# EAGLE design main (EAGLE 6.1)
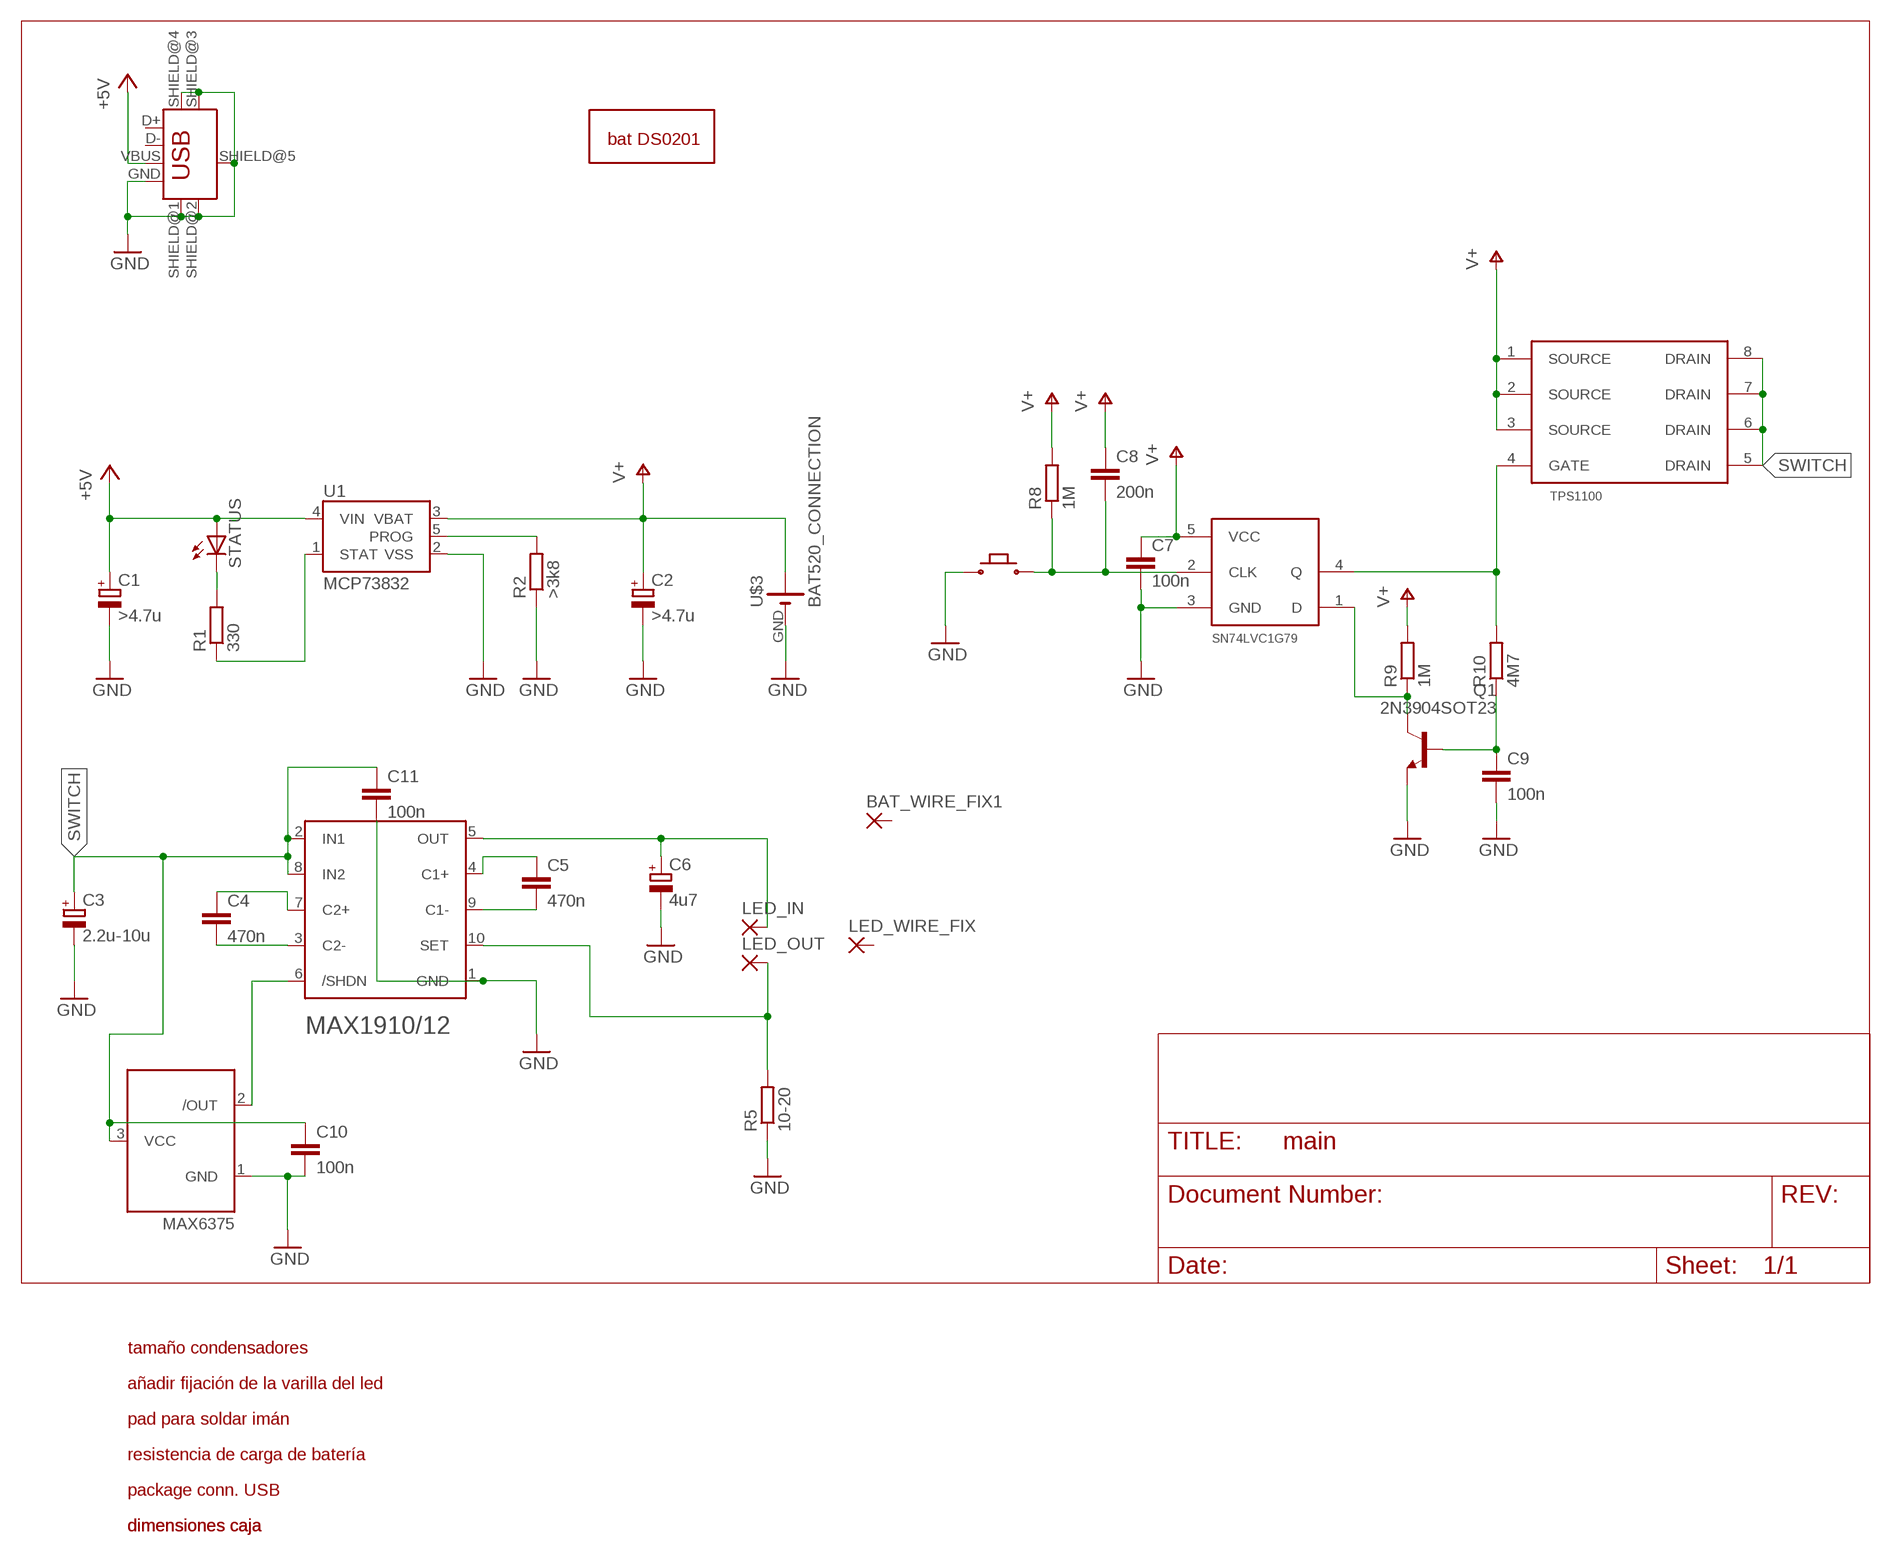
[diagram p0: schematic, sheet 1]

## Parts
BAT_WIRE_FIX1  SMD5  [SMD2,54-5,08]
C1  >4.7u  CPOL-EUSMCB  [SMC_B]
C2  >4.7u  CPOL-EUSMCB  [SMC_B]
C3  2.2u-10u  CPOL-EUSMCB  [SMC_B]
C4  470n  C-EUC1206  [C1206]
C5  470n  C-EUC1206  [C1206]
C6  4u7  CPOL-EUSMCB  [SMC_B]
C7  100n  C-EUC1206  [C1206]
C8  200n  C-EUC1206  [C1206]
C9  100n  C-EUC1206  [C1206]
C10  100n  C-EUC1206  [C1206]
C11  100n  C-EUC1206  [C1206]
LED_IN  SMD2  [SMD1,27-2,54]
LED_OUT  SMD2  [SMD1,27-2,54]
LED_WIRE_FIX  SMD5  [SMD2,54-5,08]
Q1  2N3904SOT23  [SOT23]
R1  330  R-EU_R1206  [R1206]
R2  >3k8  R-EU_R1206  [R1206]
R5  10-20  R-EU_R1206  [R1206]
R8  1M  R-EU_R0805  [R0805]
R9  1M  R-EU_R0805  [R0805]
R10  4M7  R-EU_R1206  [R1206]
STATUS  LEDCHIPLED_1206  [CHIPLED_1206]
U1  MCP73832  [SOT23-5]
U$1  MAX1910/12  [UMAX/USOP_10L]
U$2  MAX6375  [SC70-3-W]
U$3  BAT520_CONNECTION  [BAT520_CONN_SMD]
U$4  BAT_DS0201_PACKAGE  [BAT_DS0201]
U$5  MICROUSB_B  [USB-MICROB]
U$6  MICROBUTTONE-MERCHAN  [MICROBUTTON_2]
U$7  SN74LVC1G79  [SOT23-5]
U$8  TPS1100  [SO08]

## Nets
+5V: C1.+ STATUS.A U1.4(VIN) U$5.VBUS
GND: C1.- C2.- C3.- C6.- C7.2 C9.2 C10.2 C11.2 Q1.2(E) R2.1 R5.1 U1.2(VSS) U$1.1(GND) U$2.1(GND) U$3.GND(-) U$5.GND U$5.SHIELD@1(SHIELD) U$5.SHIELD@2(SHIELD) U$5.SHIELD@3(SHIELD) U$5.SHIELD@4(SHIELD) U$5.SHIELD@5(SHIELD) U$6.P$1 U$7.3(GND)
N$1: Q1.3(C) R9.1 U$7.1(D)
N$2: R1.2 STATUS.C
N$3: R2.2 U1.5(PROG)
N$4: R1.1 U1.1(STAT)
N$5: C4.2 U$1.3(C2-)
N$6: C4.1 U$1.7(C2+)
N$7: C5.2 U$1.9(C1-)
N$8: C5.1 U$1.4(C1+)
N$12: LED_OUT.1(P) R5.2 U$1.10(SET)
N$14: C6.+ LED_IN.1(P) U$1.5(OUT)
N$15: U$1.6(/SHDN) U$2.2(/OUT)
N$16: C8.2 R8.1 U$6.P$2 U$7.2(CLK)
N$18: C9.1 Q1.1(B) R10.1
N$19: R10.2 U$7.4(Q) U$8.4(GATE)
SWITCH: C3.+ C10.1 C11.1 U$1.2(IN1) U$1.8(IN2) U$2.3(VCC) U$8.5(DRAIN) U$8.6(DRAIN) U$8.7(DRAIN) U$8.8(DRAIN)
V+: C2.+ C7.1 C8.1 R8.2 R9.2 U1.3(VBAT) U$3.VCC(+) U$7.5(VCC) U$8.1(SOURCE) U$8.2(SOURCE) U$8.3(SOURCE)
Unconnected: BAT_WIRE_FIX1.1(P) LED_WIRE_FIX.1(P) U$5.D+ U$5.D-

## Notes on the sheet
- tamaño condensadores
- añadir fijación de la varilla del led
- pad para soldar imán
- resistencia de carga de batería
- package conn. USB
- dimensiones caja | dimensiones caja

## Library data of the parts
BAT_WIRE_FIX1 LED_WIRE_FIX = wirepad:SMD5: SMD PAD
C1-C3 C6 = rcl:CPOL-EU: POLARIZED CAPACITOR, European symbol
C4 C5 C7-C11 = rcl:C-EU: CAPACITOR, European symbol
LED_IN LED_OUT = wirepad:SMD2: SMD PAD
Q1 = dan:2N3904: NPN Transistor
R1 R2 R5 R8-R10 = rcl:R-EU_: RESISTOR, European symbol
STATUS = led:LED: LED OSRAM: - CHIPLED LG R971, LG N971, LY N971, LG Q971, LY Q971, LO R971, LY R971 LH N974, LH R974 LS Q976, LO Q976, LY Q976 LO Q996 - Hyper CHIPLED LW Q18S LB Q993, LB Q99A, LB R99A - SideLED LS A670, LO A670, LY A670, LG A670, LP A670 LB A673, LV A673, LT A673, LW A673 LH A674 LY A675 LS A676, LA A676, LO A676, LY A676, LW A676 LS A679, LY A679, LG A679 - Hyper Micro SIDELED® LS Y876, LA Y876, LO Y876, LY Y876 LT Y87S - SmartLED LW L88C, LW L88S LB L89C, LB L89S, LG L890 LS L89K, LO L89K, LY L89K LS L896, LA L896, LO L896, LY L896 - TOPLED LS T670, LO T670, LY T670, LG T670, LP T670 LSG T670, LSP T670, LSY T670, LOP T670, LYG T670 LG T671, LOG T671, LSG T671 LB T673, LV T673, LT T673, LW T673 LH T674 LS T676, LA T676, LO T676, LY T676, LB T676, LH T676, LSB T676, LW T676 LB T67C, LV T67C, LT T67C, LS T67K, LO T67K, LY T67K, LW E67C LS E67B, LA E67B, LO E67B, LY E67B, LB E67C, LV E67C, LT E67C LW T67C LS T679, LY T679, LG T679 LS T770, LO T770, LY T770, LG T770, LP T770 LB T773, LV T773, LT T773, LW T773 LH T774 LS E675, LA E675, LY E675, LS T675 LS T776, LA T776, LO T776, LY T776, LB T776 LHGB T686 LT T68C, LB T68C - Hyper Mini TOPLED® LB M676 - Mini TOPLED Santana® LG M470 LS M47K, LO M47K, LY M47K Source: http://www.osram.convergy.de LUXEON: - LUMILED® LXK2-PW12-R00, LXK2-PW12-S00, LXK2-PW14-U00, LXK2-PW14-V00 LXK2-PM12-R00, LXK2-PM12-S00, LXK2-PM14-U00 LXK2-PE12-Q00, LXK2-PE12-R00, LXK2-PE12-S00, LXK2-PE14-T00, LXK2-PE14-U00 LXK2-PB12-K00, LXK2-PB12-L00, LXK2-PB12-M00, LXK2-PB14-N00, LXK2-PB14-P00, LXK2-PB14-Q00 LXK2-PR12-L00, LXK2-PR12-M00, LXK2-PR14-Q00, LXK2-PR14-R00 LXK2-PD12-Q00, LXK2-PD12-R00, LXK2-PD12-S00 LXK2-PH12-R00, LXK2-PH12-S00 LXK2-PL12-P00, LXK2-PL12-Q00, LXK2-PL12-R00 Source: www.luxeon.com KINGBRIGHT: KA-3528ASYC Source: www.kingbright.com
U1 = dan:MCP73832: Microchip's MCP73832 Miniature single cell, fully integrated Li-Ion, Li-polymer charge management controller http://ww1.microchip.com/downloads/en/DeviceDoc/21984a.pdf
U$1 = dan:MAX1910/12: MAX1910/12 1.5X/2X High-Efficiency White LED Charge Pumps
U$2 = dan:MAX6375: MAX6375 3 pin, ultra-low-power sc70/sot23 voltage detectors
U$3 = dan:BAT520_CONNECTION
U$4 = dan:BAT_DS0201_PACKAGE
U$5 = dan:MICROUSB_B: USB+Shield USB connector with shield pins connectable
U$6 = dan:MICROBUTTON
U$7 = dan:SN74LVC1G79
U$8 = dan:TPS1100

## Board
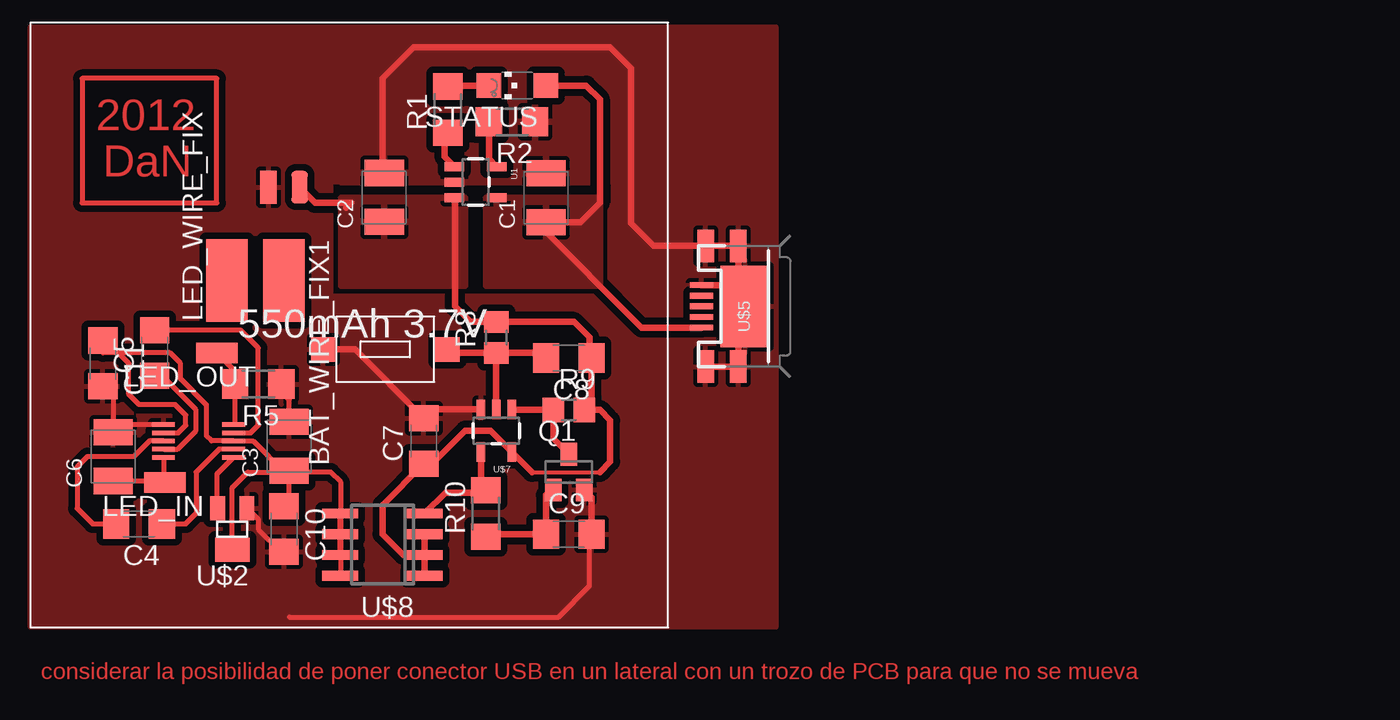
[diagram p1: board, top side]

No outline drawn. Coordinates in mm, seen from the top.
Copper layers (1*16): Top 0.035mm / dielectric 1.5mm / Bottom 0.035mm
Design rules: minimum track width 10mil, minimum drill 24mil, track to track 16mil, track to pad 16mil, pad to pad 16mil, via to via 16mil, smd to smd 16mil, copper to edge 0mil, drill to drill 8mil, minimum pad ring 10mil, minimum via ring 8mil, stop-mask expansion 4mil, vias tented up to drill 0mil, thermal gap 10mil

### Footprints (pad centres in the part's own frame; a part is rotated, then mirrored left to right if it is on the bottom)
SMD2,54-5,08 = smd 2.54 x 5.08: 1 0,0
SMC_B = smd 1.6 x 2.4: + -1.5,0; - 1.5,0
C1206 = smd 1.6 x 1.8: 1 -1.4,0; 2 1.4,0
SMD1,27-2,54 = smd 1.27 x 2.54: 1 0,0
SOT23 = smd 1 x 1.4: 1 -0.95,-1.1; 2 0.95,-1.1; 3 0,1.1
R1206 = smd 1.6 x 1.803: 1 -1.422,0; 2 1.422,0
R0805 = smd 1.3 x 1.5: 1 -0.95,0; 2 0.95,0
CHIPLED_1206 = smd 1.5 x 1.5: A 0,-1.75; C 0,1.75
SOT23-5 = smd 0.55 x 1.2: 1 -0.95,-1.3; 2 0,-1.3; 3 0.95,-1.3; 4 0.95,1.3; 5 -0.95,1.3
UMAX/USOP_10L = smd 1.4 x 0.28: 1 -2,1; 2 -2,0.5; 3 -2,0; 4 -2,-0.5; 5 -2,-1; 6 2.3,-1; 7 2.3,-0.5; 8 2.3,0; 9 2.3,0.5; 10 2.3,1
SC70-3-W = smd 0.9 x 1.45: 1 -0.9,-1.275; 2 0.9,-1.275 | smd 2.1 x 1.45: 3 0,1.275
BAT520_CONN_SMD = smd 1 x 2: GND 0.635,0; VCC -1.27,0
USB-MICROB = smd 0.35 x 1.4: D+ 0,2.65; D- -0.65,2.65; GND 1.3,2.65; ID 0.65,2.65; VBUS -1.3,2.65 | smd 2 x 1: SHIELD@1 -3.7,2.4; SHIELD@2 -3.7,0.4; SHIELD@4 3.7,0.4; SHIELD@5 3.7,2.4 | smd 5 x 3: SHIELD@3 0,0
MICROBUTTON_2 = smd 1.5 x 1.5: P$1 3.625,0.095; P$2 -3.975,0.095
SO08 = smd 0.6 x 2.2: 1 -1.905,-2.6; 2 -0.635,-2.6; 3 0.635,-2.6; 4 1.905,-2.6; 5 1.905,2.6; 6 0.635,2.6; 7 -0.635,2.6; 8 -1.905,2.6

### Placement (x,y rotation side)
BAT_WIRE_FIX1  18.1,19.37 180 top
C1  34.17,24.44 90 top
C2  24.25,24.46 90 top
C3  18.41,9.21 90 top
C4  9.21,4.45 180 top
C5  10.16,14.92 90 top
C6  7.62,8.57 90 top
C7  26.67,9.53 90 top
C8  35.56,14.61 180 top
C9  35.56,3.81 0 top
C10  18.1,4.13 270 top
C11  6.99,14.29 270 top
LED_IN  10.79,6.99 90 top
LED_OUT  13.97,14.92 90 top
LED_WIRE_FIX  14.61,19.37 0 top
Q1  35.56,7.62 0 top
R1  28.14,29.84 90 top
R2  32.08,29.09 180 top
R5  16.51,13.02 180 top
R8  31.11,15.88 90 top
R9  35.56,11.43 0 top
R10  30.48,5.08 90 top
STATUS  32.4,31.32 90 top
U1  29.84,25.4 270 top
U$1  12.7,9.53 0 top
U$2  14.92,4.13 180 top
U$3  17.78,25.08 180 top
U$4  21.59,17.14 0 top
U$5  46.35,17.78 90 top
U$6  24.13,15.24 180 top
U$7  31.11,10.16 180 top
U$8  24.13,3.17 90 top

### Tracks (layer width: path | path; a pad name or v marks a point on that pad's centre or on a via)
+5V
  Top 0.406: STATUS.A 36.63,31.32 37.47,30.48 37.47,24.13 36.27,22.94 C1.+ | U$5.VBUS 40.03,16.48 33.66,22.86
  pour Top: 30.48,24.45 30.48,19.05 37.47,19.05 37.47,24.45
GND
  Top 0.305: 17.78,12.7 18.41,12.06 C3.- 18.5,10.79 | 7.3,10.39 C6.- 8.07,10.53 U$1.1 | C11.2 7.62,12.25 7.62,10.16 | U$2.1 16.51,4.71 16.51,4.13 17.91,2.73 C10.2 | 18.41,-1.27 34.92,-1.27 36.83,0.64 36.83,3.68 C9.2
  Top 0.406: Q1.2 36.96,6.07 C9.2 | C7.2 27.3,11.43 | C7.2 26.67,10.79 | C7.2 27.2,11.46 U$7.3 | U$6.P$1 22.45,15.14 C7.2 | U$5.SHIELD@1 U$5.SHIELD@2 45.95,17.38 U$5.SHIELD@3 45.95,18.18 45.95,19.05 | 45.95,19.05 U$5.SHIELD@4 U$5.SHIELD@5 40.75,21.48 39.37,22.86 39.37,32.38 38.1,33.66 26.04,33.66 24.13,31.75 24.13,26.07 C2.- | 45.95,19.05 45.92,19.08 U$5.GND
  pour Top: 37.47,25.4 21.59,25.4 21.59,32.38 37.47,32.38
  pour Top: 2.54,34.92 41.59,34.92 41.59,25.4 20.95,25.4 20.95,18.41 41.59,18.41 41.59,-1.91 2.54,-1.91
  pour Top: 48.26,-1.91 38.1,-1.91 38.1,34.92 48.26,34.92
N$1
  Top 0.406: U$7.1 32.09,11.43 R9.1 | R9.1 34.92,11.43 | Q1.3 34.61,9.67 R9.1
N$2
  Top 0.406: 30.58,31.26 STATUS.C 28.2,31.32 R1.2
N$3
  Top 0.406: U1.5 30.66,26.84 R2.2
N$4
  Top 0.305: 27.94,28.57 28.1,28.41 R1.1
  Top 0.406: U1.1 27.94,26.95 27.94,28.57
N$5
  Top 0.305: U$1.3 9.84,9.53 8.89,8.57 6.03,8.57 5.4,7.94 5.4,5.4 6.35,4.45 C4.2
N$6
  Top 0.305: U$1.7 14.11,9.03 12.7,7.62 12.7,5.08 12.06,4.45 C4.1
N$7
  Top 0.305: U$1.9 16.06,10.03 16.51,10.48 16.51,15.24 15.43,16.32 C5.2
N$8
  Top 0.305: U$1.4 11.56,9.03 12.7,10.16 12.7,11.43 10.61,13.52 C5.1
N$9
  Top 0.305: 5.71,24.13 13.97,24.13 13.97,31.75 5.71,31.75 5.71,24.13
N$12
  Top 0.305: U$1.10 15.09,10.61 R5.2 15.09,13.8 LED_OUT.1
N$14
  Top 0.305: U$1.5 10.7,7.08 LED_IN.1 10.71,7.07 C6.+
N$15
  Top 0.305: U$1.6 13.97,7.5 13.97,5.08 14.02,5.13 U$2.2
N$16
  Top 0.305: R8.1 31.11,14.61
  Top 0.406: 33.98,14.61 C8.2 33.84,14.93 R8.1 28.32,14.93 U$6.P$2 | U$7.2 31.11,14.61
N$18
  Top 0.406: Q1.1 34.44,6.35 34.29,6.35 34.16,6.22 C9.1 | R10.1 30.63,3.81 C9.1 | C9.1 34.29,3.81
N$19
  Top 0.406: U$7.4 30.16,6.5 | 30.16,6.5 R10.2 | U$8.4 28,6.35 30.32,6.35 | 30.16,6.5 30.32,6.35 | 30.32,6.35 30.48,6.35
SWITCH
  Top 0.305: U$1.2 11.61,10.03 12.06,10.48 12.06,11.11 11.43,11.75 9.21,11.75 8.57,12.38 8.57,14.29 6.99,15.88 C11.1 6.99,14.92 11.11,14.92 11.75,14.29 11.75,13.34 13.34,11.75 13.34,9.84 13.65,9.53 U$1.8 16.19,9.53 18.1,7.62 | 18.1,7.62 18.41,7.62 | 15.37,2.41 U$2.3 14.92,6.67 15.88,7.62 18.1,7.62 | C10.1 18.41,5.84 18.41,7.62 | U$8.8 21.59,1.33 21.59,5.02 | 21.59,5.02 U$8.5 U$8.6 | 18.41,7.62 C3.+ 18.5,7.62 20.95,7.62 21.59,6.99 21.59,5.02 | U$8.7 U$8.6 | 21.59,5.02 21.53,5.02 U$8.6
V+
  Top 0.254: 33.3,7.62 37.47,7.62
  Top 0.305: R9.2 36.83,11.43 | 28.57,24.13 28.55,24.13 U1.3
  Top 0.406: R9.2 36.96,11.88 C8.1 36.83,14.61 36.83,15.88 35.88,16.82 R8.2 29.53,16.82 28.57,17.78 28.57,24.13 | U$8.1 U$8.2 | U$8.2 26.67,2.54 26.73,2.6 U$8.3 | U$8.2 25.4,2.54 24.13,3.81 24.13,5.58 C7.1 27.18,8.12 29.21,10.16 30.77,10.16 U$7.5 33.3,7.62 | 37.47,7.62 38.1,8.26 38.1,10.79 37.47,11.43 36.83,11.43 | 21.91,23.81 22.23,24.13 20,24.13 U$3.VCC
  pour Top: 29.21,24.45 29.21,19.05 21.59,19.05 21.59,24.45

### Text on the board
Top: 2012 | DaN | considerar la posibilidad de poner conector USB en un lateral con un trozo de PCB para que no se mueva